# Altium schematic sheet DM1095_USB.SchDoc: =project_title
size Tabloid; PageSetup: Record=PageOptions|CenterHorizontal=True|CenterVertical=True|PrintScale=0.73|XCorrection=1.00|YCorrection=1.00|PrintKind=0|BorderSize=5000000|LeftOffset=0|BottomOffset=0|Orientation=2|PaperLength=1000|PaperWidth=1000|Scale=100|PaperSource=7|PrintQuality=-4|MediaType=1|DitherType=10|PaperKind=A4|PrintScaleMode=1; CompanyName: Luxonis Holding; Organization: Luxonis Holding; Address1: 1925 Harmony Park Drive; Address2: Westminster, CO; Address3: 80234; Address4: United States; SheetNumber: 8; SheetTotal: 9
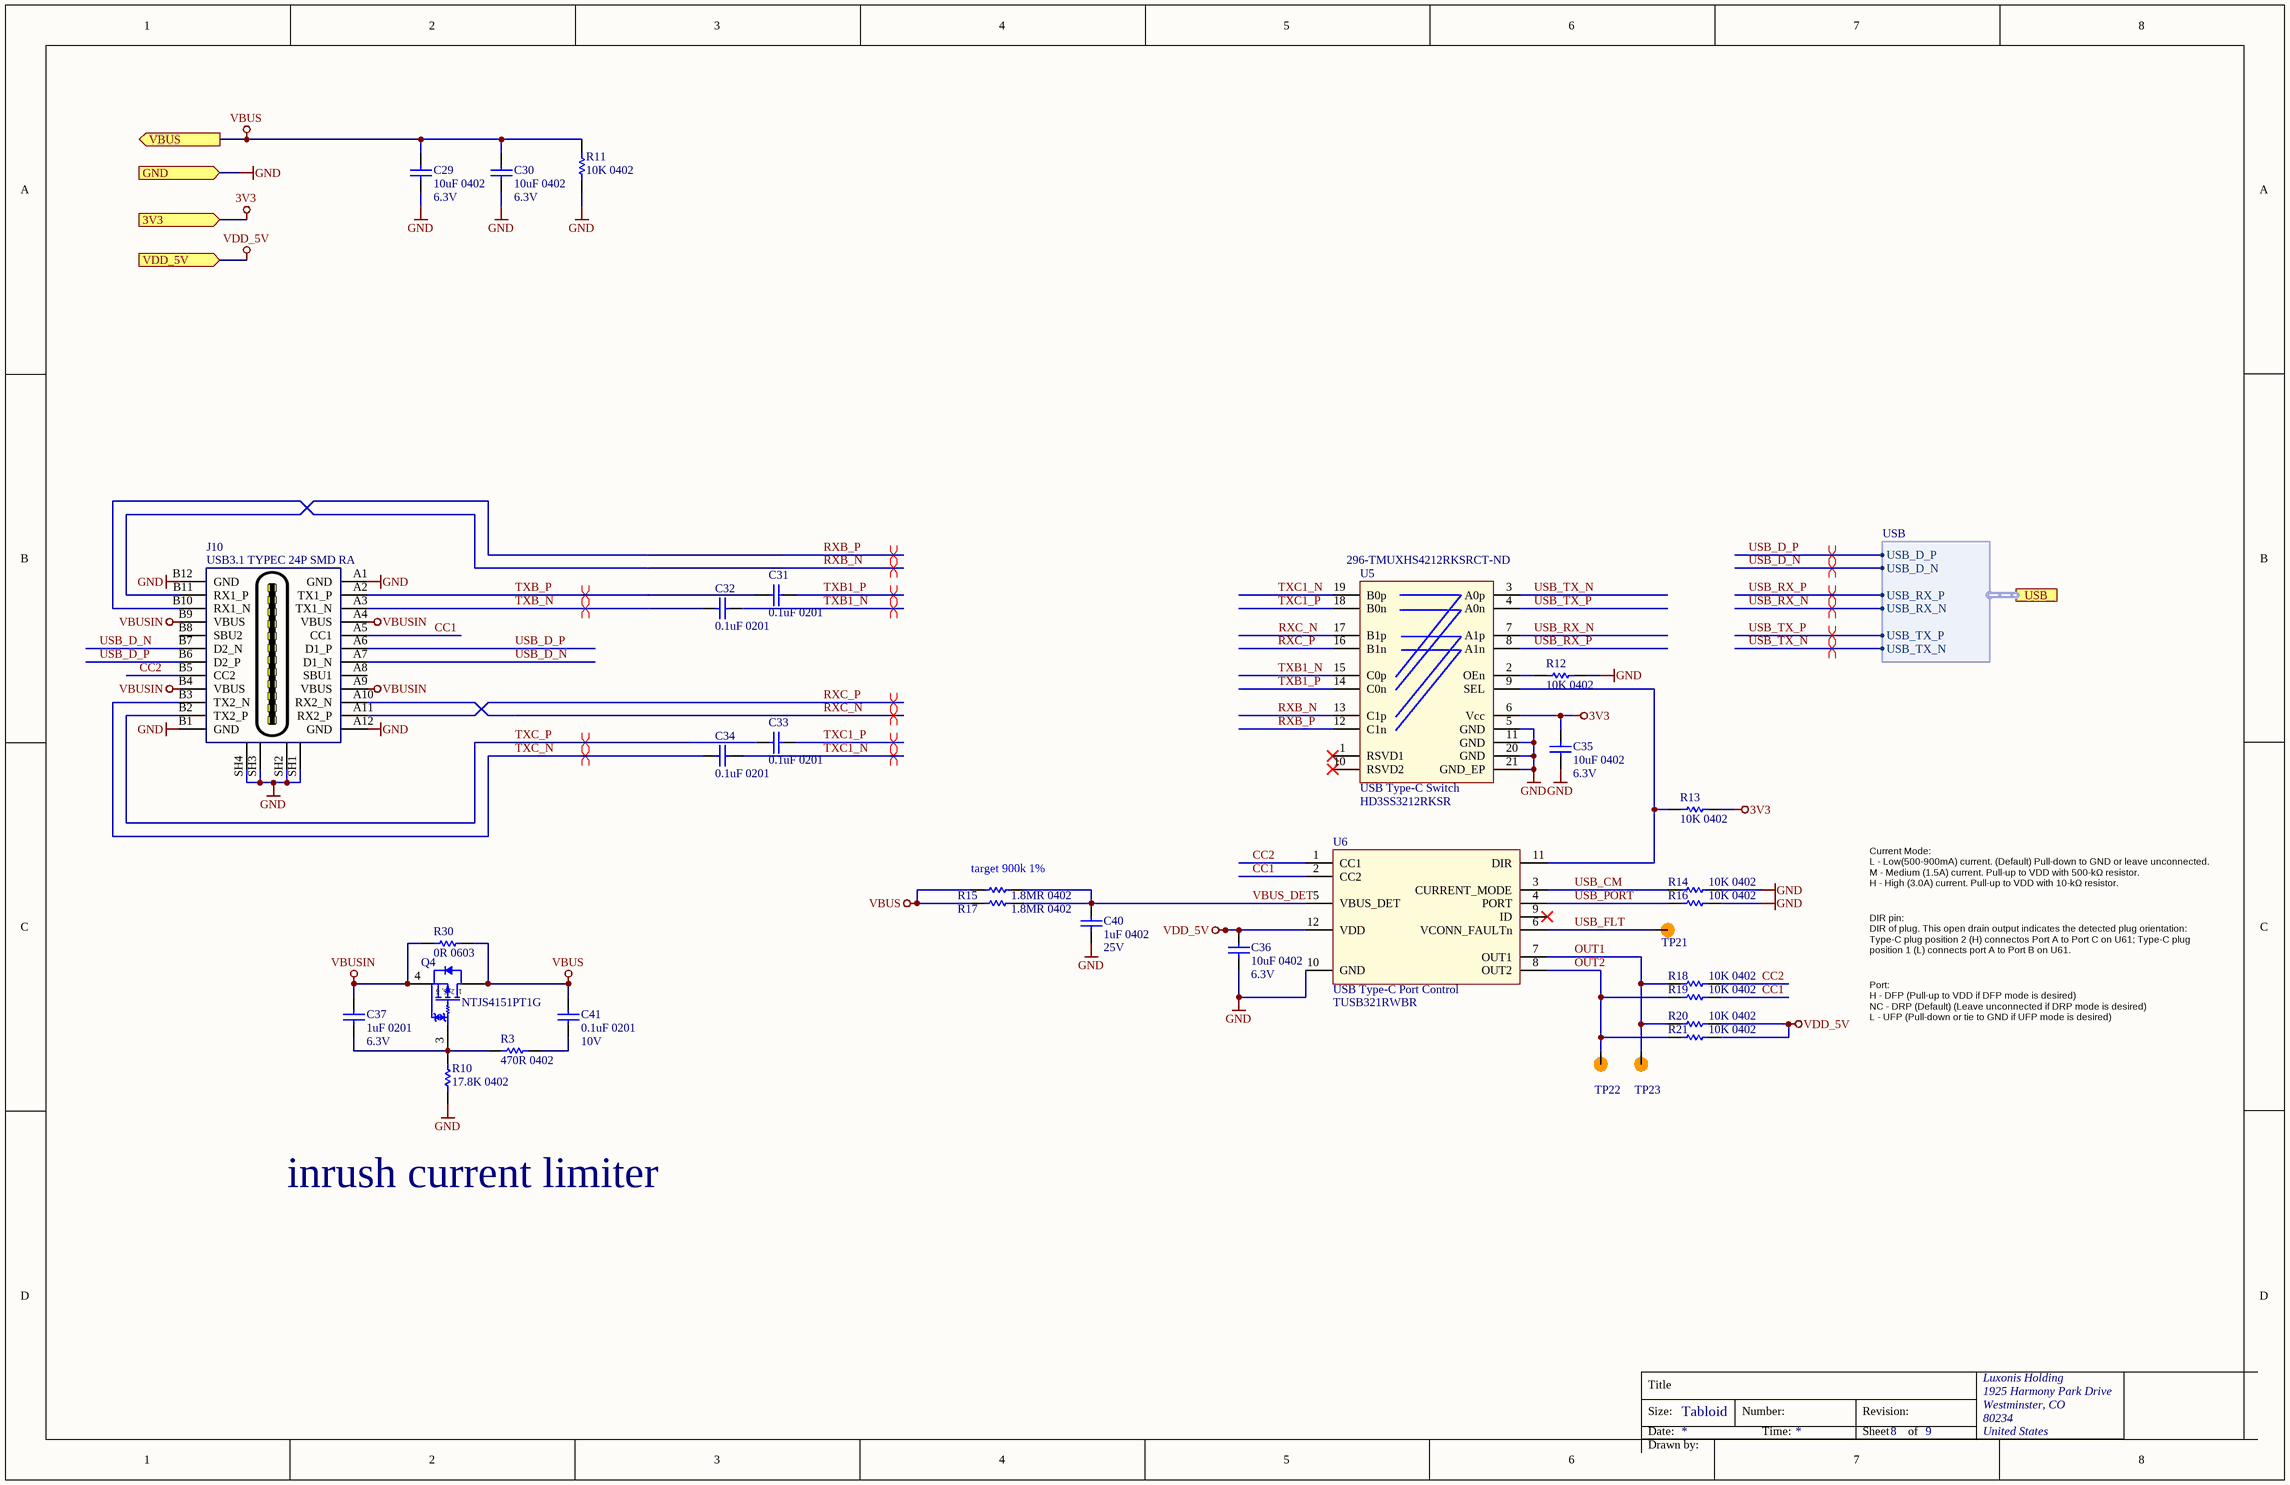
[diagram p0: DM1095_USB.SchDoc]

## Parts
C29  10uF 0402  Voltage Rating: 6.3V  [CAPC0402(1005)70_L]
C30  10uF 0402  Voltage Rating: 6.3V  [CAPC0402(1005)70_L]
C31  0.1uF 0201  [CAPC0201(0603)33_L]
C32  0.1uF 0201  [CAPC0201(0603)33_L]
C33  0.1uF 0201  [CAPC0201(0603)33_L]
C34  0.1uF 0201  [CAPC0201(0603)33_L]
C35  10uF 0402  Voltage Rating: 6.3V  [CAPC0402(1005)70_L]
C36  10uF 0402  Voltage Rating: 6.3V  [CAPC0402(1005)70_L]
C37  1uF 0201  Voltage: 6.3V  [CAPC0201(0603)33_N]
C40  1uF 0402  Voltage Rating: 25V  [CAPC0402(1005)70_N]
C41  0.1uF 0201  Voltage: 10V  [CAPC0201(0603)33_N]
J10  USB3.1 TYPEC 24P SMD RA  [105450-0101]
Q4  NTJS4151PT1G  [ONSC-SC70-6-419B-02_W_V]
R3  470R 0402  [RESC0402(1005)_L]
R10  17.8K 0402  [RESC0402(1005)_L]
R11  10K 0402  [RESC0402(1005)_L]
R12  10K 0402  [RESC0402(1005)_L]
R13  10K 0402  [RESC0402(1005)_L]
R14  10K 0402  [RESC0402(1005)_L]
R15  1.8MR 0402  [RESC0402(1005)_L]
R16  10K 0402  [RESC0402(1005)_L]
R17  1.8MR 0402  [RESC0402(1005)_L]
R18  10K 0402  [RESC0402(1005)_L]
R19  10K 0402  [RESC0402(1005)_L]
R20  10K 0402  [RESC0402(1005)_L]
R21  10K 0402  [RESC0402(1005)_L]
R30  0R 0603  [RESC0603(1608)_N]
TP21  TP100_200_NS  [TP100_200_NS]  (value not drawn)  (no BOM)
TP22  TP100_200_NS  [TP100_200_NS]  (value not drawn)  (no BOM)
TP23  TP100_200_NS  [TP100_200_NS]  (value not drawn)  (no BOM)
U5  USB Type-C Switch  Supplier Part Number 2: 296-TMUXHS4212RKSRCT-ND  [HD3SS3212RKSR]
U6  USB Type-C Port Control  [TUSB321RWBR]

## Ports
3V3 (in), GND (in), USB (harness USB), VBUS (out), VDD_5V (in)

## Harnesses
USB: USB_D_P, USB_D_N, USB_TX_N, USB_TX_P, USB_RX_N, USB_RX_P

## Nets
3V3: C35.2 R13.2 U5.6(Vcc) ; port 3V3
GND: C29.1 C30.1 C35.1 C36.1 C40.1 J10.A1(GND) J10.A12(GND) J10.B1(GND) J10.B12(GND) J10.SH1(SH) J10.SH2(SH) J10.SH3(SH) J10.SH4(SH) R10.1 R11.1 R12.2 R14.2 R16.2 U5.5(GND) U5.11(GND) U5.20(GND) U5.21(GND_EP) U6.10(GND) ; port GND
VBUS: C29.2 C30.2 C41.2 Q4.1(D) Q4.2(D) Q4.5(D) Q4.6(D) R11.2 R15.1 R17.1 R30.2 ; port VBUS
VBUSIN: C37.2 J10.A4(VBUS) J10.A9(VBUS) J10.B4(VBUS) J10.B9(VBUS) Q4.4(S) R30.1
VDD_5V: C36.2 R20.2 R21.2 U6.12(VDD) ; port VDD_5V
CC1: J10.A5(CC1) R19.2 U6.2(CC2)
CC2: J10.B5(CC2) R18.2 U6.1(CC1)
OUT1: R18.1 R20.1 TP23.1 U6.7(OUT1)
OUT2: R19.1 R21.1 TP22.1 U6.8(OUT2)
RXB_N: J10.B10(RX1_N) U5.13(C1p)
RXB_P: J10.B11(RX1_P) U5.12(C1n)
RXC_N: J10.A10(RX2_N) U5.17(B1p)
RXC_P: J10.A11(RX2_P) U5.16(B1n)
TXB1_N: C32.2 U5.15(C0p)
TXB1_P: C31.2 U5.14(C0n)
TXB_N: C32.1 J10.A3(TX1_N)
TXB_P: C31.1 J10.A2(TX1_P)
TXC1_N: C34.2 U5.19(B0p)
TXC1_P: C33.2 U5.18(B0n)
TXC_N: C34.1 J10.B3(TX2_N)
TXC_P: C33.1 J10.B2(TX2_P)
USB_CM: R14.1 U6.3(CURRENT_MODE)
USB_D_N: J10.A7(D1_N) J10.B7(D2_N) ; port USB.USB_D_N
USB_D_P: J10.A6(D1_P) J10.B6(D2_P) ; port USB.USB_D_P
USB_FLT: TP21.1 U6.6(VCONN_FAULTn)
USB_PORT: R16.1 U6.4(PORT)
USB_RX_N: U5.7(A1p) ; port USB.USB_RX_N
USB_RX_P: U5.8(A1n) ; port USB.USB_RX_P
USB_TX_N: U5.3(A0p) ; port USB.USB_TX_N
USB_TX_P: U5.4(A0n) ; port USB.USB_TX_P
VBUS_DET: C40.2 R15.2 R17.2 U6.5(VBUS_DET)
NetC37_1: C37.1 Q4.3(G) R3.1 R10.2
NetC41_1: C41.1 R3.2
NetR12_1: R12.1 U5.2(OEn)
NetR13_1: R13.1 U5.9(SEL) U6.11(DIR)

Not connected (* = marked no-connect by the designer): J10 A8(SBU1) B8(SBU2); U5 1(RSVD1)* 10(RSVD2)*; U6 9(ID)*

## Layout directives
differential pair; differential pair class USB3: RXB_N, RXB_P, RXC_N, RXC_P, TXB1_N, TXB1_P, TXB_N, TXB_P, TXC1_N, TXC1_P, TXC_N, TXC_P, USB_D_N, USB_D_P, USB_RX_N, USB_RX_P, USB_TX_N, USB_TX_P

## Notes on the sheet
- (near R15) target 900k 1%
- Current Mode:
  L - Low(500-900mA) current. (Default) Pull-down to GND or leave unconnected.
  M - Medium (1.5A) current. Pull-up to VDD with 500-kΩ resistor.
  H - High (3.0A) current. Pull-up to VDD with 10-kΩ resistor.
- DIR pin:
  DIR of plug. This open drain output indicates the detected plug orientation: Type-C plug position 2 (H) connectos Port A to Port C on U61; Type-C plug position 1 (L) connects port A to Port B on U61.
- Port:
  H - DFP (Pull-up to VDD if DFP mode is desired)
  NC - DRP (Default) (Leave unconnected if DRP mode is desired)
  L - UFP (Pull-down or tie to GND if UFP mode is desired)
- inrush current limiter
- Title
- Size:
- Date:
- Tabloid
- Number:
- Time:
- Revision:
- Sheet
- of
- Drawn by:
- (in symbol NTJS4151PT1G) 1, 2, 5, 6

## Library data of the parts
C29 C30 C35 C36 = GRM155R60J106ME15D: CAP CER 10UF 6.3V X5R 0402 20%; Manufacturer 1: Murata; Supplier 1: Digi-Key; Manufacturer Part Number 1: GRM155R60J106ME15D; Stock 1: 1839627; Pricing 1: 1=0.23000, 10=0.15700, 100=0.07950, 500=0.05442, 1000=0.04814, 2500=0.04605, 5000=0.04186 (USD); RoHS: Yes; Mount: Surface Mount; Case/Package: 0402; Case Code (Metric): 1005; Case Code (Imperial): 0402; Min Operating Temperature: -55°C; Max Operating Temperature: 85°C; Packaging: Tape and Reel; Capacitance: 10uF; Dielectric: X5R; Length: 0.039inch; Width: 0.02inch; ComponentLink1URL: https://www.murata.com/~/media/webrenewal/support/library/catalog/products/capacitor/mlcc/c02e.ashx?la=en-us&src-supplier=Digi-Key; ComponentLink1Description: https://www.murata.com/~/media/webrenewal/support/library/catalog/products/capacitor/mlcc/c02e.ashx?la=en-us&src-supplier=Digi-Key; Supplier Part Number 1: 490-13238-1-ND; Voltage Rating (DC): 6.3V; Thickness: 0.026inch; Tolerance: 20%
C31-C34 C41 = GRM033R61A104KE15D: CAP CER 0.1UF 10V X5R 0201; Manufacturer 1: Murata; Capacitance: 100nF; Tolerance: 10%; Supplier 1: Digi-Key; Manufacturer Part Number 1: GRM033R61A104KE15D; Stock 1: 45335312; Pricing 1: 1=0.10000, 10=0.04200, 100=0.01860, 500=0.01330, 1000=0.01045, 2500=0.00950, 5000=0.00874 (USD); RoHS: Yes; Mount: Surface Mount; Case/Package: 0201; Weight: 6E-06oz; Case Code (Metric): 0603; Case Code (Imperial): 0201; Min Operating Temperature: -55°C; Max Operating Temperature: 85°C; Packaging: Tape and Reel; Voltage Rating: 10V; Package Quantity: 1; Voltage Rating (DC): 10V; Dielectric: X5R; Termination: SMD/SMT; Length: 0.6mm; Height: 0.3mm; Width: 0.012inch; Thickness: 0.013inch; Depth: 0.3mm; Radiation Hardening: No; Lead Free: Lead Free; REACH SVHC: No SVHC; ComponentLink1URL: https://datasheet.ciiva.com/26843/getdatasheetpartid-308656-26843739.pdf?src-supplier=Verical; ComponentLink1Description: https://datasheet.ciiva.com/26843/getdatasheetpartid-308656-26843739.pdf?src-supplier=Verical; ComponentLink2URL: https://datasheet.ciiva.com/5413/product-5413117.pdf?src-supplier=Mouser; ComponentLink2Description: https://datasheet.ciiva.com/5413/product-5413117.pdf?src-supplier=Mouser; ComponentLink3URL: https://datasheet.ciiva.com/6256/partnumbering-e-01-6256406.pdf?src-supplier=Digi-Key; ComponentLink3Description: https://datasheet.ciiva.com/6256/partnumbering-e-01-6256406.pdf?src-supplier=Digi-Key; ComponentLink4URL: https://datasheet.ciiva.com/6256/partnumbering-e-01-6256407.pdf?src-supplier=Digi-Key; ComponentLink4Description: https://datasheet.ciiva.com/6256/partnumbering-e-01-6256407.pdf?src-supplier=Digi-Key; ComponentLink5URL: https://datasheet.ciiva.com/6256/partnumbering-e-01-6256408.pdf?src-supplier=Digi-Key; ComponentLink5Description: https://datasheet.ciiva.com/6256/partnumbering-e-01-6256408.pdf?src-supplier=Digi-Key; Supplier Part Number 1: 490-5881-1-ND
  C31-C34: Voltage: 10V
C37 = GRM033R60J105MEA2D: CAP CER 1UF 6.3V X5R 0201 20%; Manufacturer 1: Murata; Supplier 1: Digi-Key; Manufacturer Part Number 1: GRM033R60J105MEA2D; Stock 1: 26228841; Pricing 1: 1=0.12000, 10=0.08500, 100=0.04000, 500=0.02806, 1000=0.02323, 2500=0.02162, 5000=0.01978 (USD); RoHS: Yes; Mount: Surface Mount; Case/Package: 0201; Weight: 1.2E-05oz; Case Code (Imperial): 0201; Case Code (Metric): 0603; Min Operating Temperature: -55°C; Max Operating Temperature: 85°C; Packaging: Cut Tape; Capacitance: 1uF; Tolerance: 20%; Voltage Rating: 6.3V; Voltage Rating (DC): 6.3V; Dielectric: X5R; Package Quantity: 1; Termination: SMD/SMT; Length: 0.6mm; Height: 0.3mm; Width: 0.3mm; Thickness: 300um; Depth: 0.3mm; REACH SVHC: No SVHC; Lead Free: Lead Free; ComponentLink1URL: https://datasheet.ciiva.com/18699/grm033r60j105mea2-02-18699520.pdf?src-supplier=Digi-Key; ComponentLink1Description: https://datasheet.ciiva.com/18699/grm033r60j105mea2-02-18699520.pdf?src-supplier=Digi-Key; ComponentLink2URL: https://datasheet.ciiva.com/24218/c02e-24218376.pdf?src-supplier=Mouser; ComponentLink2Description: https://datasheet.ciiva.com/24218/c02e-24218376.pdf?src-supplier=Mouser; ComponentLink3URL: https://datasheet.ciiva.com/18699/partnumbering-e-01-18699519.pdf?src-supplier=Digi-Key; ComponentLink3Description: https://datasheet.ciiva.com/18699/partnumbering-e-01-18699519.pdf?src-supplier=Digi-Key; Supplier Part Number 1: 490-7229-1-ND
C40 = GRM155R61E105KA12D: CAP CER 1UF 25V X5R 0402 10%; Manufacturer 1: Murata; Material: Ceramic; Supplier 1: Digi-Key; Manufacturer Part Number 1: GRM155R61E105KA12D; Stock 1: 200653; Pricing 1: 1=0.10000, 10=0.07100, 100=0.03350, 500=0.02352, 1000=0.01947, 2500=0.01812, 5000=0.01658 (USD); RoHS: Yes; Mount: Surface Mount; Case/Package: 0402; Weight: 0.000212oz; Case Code (Metric): 1005; Case Code (Imperial): 0402; Min Operating Temperature: -55°C; Max Operating Temperature: 85°C; Tolerance: 10%; Capacitance: 1uF; Dielectric: X5R; Voltage Rating (DC): 25V; Packaging: Tape and Reel; Package Quantity: 10000; Termination: SMD/SMT; Voltage: 25V; Length: 1mm; Height: 0.5mm; Width: 0.5mm; Thickness: 0.022inch; Depth: 0.5mm; Lead Free: Lead Free; REACH SVHC: No SVHC; ComponentLink1URL: https://datasheet.ciiva.com/22732/1666664-22732122.pdf?src-supplier=Element14; ComponentLink1Description: https://datasheet.ciiva.com/22732/1666664-22732122.pdf?src-supplier=Element14; ComponentLink2URL: https://datasheet.ciiva.com/7719/1666664-7719006.pdf?src-supplier=Element14; ComponentLink2Description: https://datasheet.ciiva.com/7719/1666664-7719006.pdf?src-supplier=Element14; Supplier Part Number 1: 490-10017-1-ND; Supplier 2: Arrow; Supplier 3: TTI; Supplier Part Number 2: GRM155R61E105KA12D; Supplier Part Number 3: GRM155R61E105KA12D
J10 = 105450-0101: CONN RCP USB3.1 TYPEC 24P SMD RA; Manufacturer 1: Molex; Connector Type: USB; Number of Contacts: 24; Gender: Receptacle; Number of Ports: 1; Current Rating: 5A; Mating Cycles: 10000; Shielding: Shielded; Pitch: 0.5mm; Supplier 1: Digi-Key; Manufacturer Part Number 1: 105450-0101; Stock 1: 13882; Pricing 1: 1=2.15000, 10=1.94900, 25=1.82960, 50=1.75000, 100=1.67050, 250=1.51140, 500=1.39208 (USD); RoHS: Yes; Mount: Surface Mount,Through Hole,Horizontal; Case/Package: 0101; Number of Pins: 24; Contact Material: Copper Alloy; Contact Plating: Gold; Number of Terminals: 24; Housing Material: Thermoplastic; Insulation Color: Black; Min Operating Temperature: -30°C; Max Operating Temperature: 85°C; Packaging: Tape and Reel; Orientation: Right Angle; Termination: Solder; USB Standard: USB 3.1; Features: Shielded; Length: 8.94mm; REACH SVHC: Unknown; Flammability Rating: UL94 V-0; ComponentLink1URL: http://www.farnell.com/datasheets/2673427.pdf?src-supplier=Farnell; ComponentLink1Description: http://www.farnell.com/datasheets/2673427.pdf?src-supplier=Farnell; ComponentLink2URL: http://www.farnell.com/datasheets/2801634.pdf?src-supplier=Farnell; ComponentLink2Description: http://www.farnell.com/datasheets/2801634.pdf?src-supplier=Farnell; ComponentLink3URL: http://www.farnell.com/datasheets/2672741.pdf?src-supplier=Newark; ComponentLink3Description: http://www.farnell.com/datasheets/2672741.pdf?src-supplier=Newark; ComponentLink4URL: https://www.molex.com/pdm_docs/sd/1054500101_sd.pdf?src-supplier=Digi-Key; ComponentLink4Description: https://www.molex.com/pdm_docs/sd/1054500101_sd.pdf?src-supplier=Digi-Key; ComponentLink5URL: https://www.molex.com/pdm_docs/ps/PS-105448-001.pdf?src-supplier=Digi-Key; ComponentLink5Description: https://www.molex.com/pdm_docs/ps/PS-105448-001.pdf?src-supplier=Digi-Key; ComponentLink6URL: http://www.farnell.com/datasheets/2015275.pdf?src-supplier=Element14; ComponentLink6Description: http://www.farnell.com/datasheets/2015275.pdf?src-supplier=Element14; ComponentLink7URL: http://www.literature.molex.com/SQLImages/kelmscott/Molex/PDF_Images/987651-4081.PDF?src-supplier=Avnet; ComponentLink7Description: http://www.literature.molex.com/SQLImages/kelmscott/Molex/PDF_Images/987651-4081.PDF?src-supplier=Avnet; ComponentLink8URL: http://www.literature.molex.com/SQLImages/kelmscott/Molex/PDF_Images/987651-4081.PDF?src-supplier=Avnet+Asia; ComponentLink8Description: http://www.literature.molex.com/SQLImages/kelmscott/Molex/PDF_Images/987651-4081.PDF?src-supplier=Avnet+Asia; Supplier Part Number 1: WM12856CT-ND; Supplier 2: Newark; Supplier 3: Mouser; Supplier Part Number 2: 02AH5567; Supplier Part Number 3: 538-105450-0101
Q4 = NTJS4151PT1G: Trench Power MOSFET, -20 V, -4.2 A, Single P-Channel, 6-Pin SC70, Pb-Free, Tape and Reel; Manufacturer 1: ON Semiconductor; VGS(th) Max (V): 1.2; VGS Max (V): 12; Crss Typ (pF): 110; Ciss Typ (pF): 850; PD Max (W): 1; Qrr Typ (nC): 0.23; ID Max (A): 4.2; Coss Typ (pF): 160; Channel Polarity: P Channel; V(BR)DSS Min (V): 20; Mounting Technology: Surface Mount; ComponentLink3Description: Package Specification; Packing: Tape and Reel; DatasheetVersion: Rev. 1; RoHS: Pb-Free; Configuration: Single; PackageReference: SC70-6-419B-02_W; PackageVersion: Rev. W; Package Type: SC-88-6 / SC-70-6 / SOT-363-6; ComponentLink3URL: http://www.onsemi.com/pub_link/Collateral/SMF05C-D.PDF; PackageDescription: 6-Pin Small Outline Transistor, Body 2 x 1.25 mm, Pitch 0.65 mm; PartNumber: NTJS4151PT1G; ComponentLink2Description: Datasheet; ComponentLink1Description: Manufacturer URL; ComponentLink2URL: http://www.onsemi.com/pub_link/Collateral/NTJS4151P-D.PDF; ComponentLink1URL: http://www.onsemi.com/; Manufacturer Part Number 1: NTJS4151PT1G
R3 = CRCW0402470RFKED: RES SMD 470 OHM 1% 1/16W 0402; Manufacturer 1: Vishay; Temperature Coefficient: 100ppm/°C; Power Rating: 63mW; Voltage Rating: 50V; Supplier 1: Digi-Key; Manufacturer Part Number 1: CRCW0402470RFKED; Stock 1: 9199; Pricing 1: 1=0.10000, 10=0.03800, 100=0.01540, 1000=0.00690, 2500=0.00599, 5000=0.00495 (USD); RoHS: Yes; Mount: Surface Mount; Case/Package: 0402; Weight: 2.3E-05oz; Case Code (Imperial): 0402; Case Code (Metric): 1005; Contact Plating: Tin; Min Operating Temperature: -55°C; Max Operating Temperature: 155°C; Resistance: 470R; Tolerance: 1%; Composition: Thick Film; Packaging: Tape and Reel; Voltage Rating (DC): 50V; Termination: SMD/SMT; Number of Terminations: 2; Package Quantity: 10; Military Standard: Not; Max Power Dissipation: 63mW; Features: Automotive AEC-Q200; Length: 1mm; Height: 0.35mm; Width: 0.5mm; Depth: 0.5mm; Radiation Hardening: No; REACH SVHC: Unknown; Lead Free: Lead Free; ComponentLink1URL: https://datasheet.ciiva.com/11811/0900766b80d98824-11811416.pdf?src-supplier=RSComponents; ComponentLink1Description: https://datasheet.ciiva.com/11811/0900766b80d98824-11811416.pdf?src-supplier=RSComponents; ComponentLink2URL: https://datasheet.ciiva.com/16764/70201119-16764886.pdf?src-supplier=Allied+Electronics; ComponentLink2Description: https://datasheet.ciiva.com/16764/70201119-16764886.pdf?src-supplier=Allied+Electronics; ComponentLink3URL: https://datasheet.ciiva.com/28613/1720486-28613479.pdf?src-supplier=Element14; ComponentLink3Description: https://datasheet.ciiva.com/28613/1720486-28613479.pdf?src-supplier=Element14; ComponentLink4URL: https://datasheet.ciiva.com/3256/dcrcwe3-3256553.pdf?src-supplier=Avnet; ComponentLink4Description: https://datasheet.ciiva.com/3256/dcrcwe3-3256553.pdf?src-supplier=Avnet; ComponentLink5URL: https://datasheet.ciiva.com/7777/1720486-7777243.pdf?src-supplier=Element14; ComponentLink5Description: https://datasheet.ciiva.com/7777/1720486-7777243.pdf?src-supplier=Element14; ComponentLink6URL: https://datasheet.ciiva.com/8336/dcrcwe3-8336715.pdf?src-supplier=Avnet; ComponentLink6Description: https://datasheet.ciiva.com/8336/dcrcwe3-8336715.pdf?src-supplier=Avnet; ComponentLink7URL: https://datasheet.ciiva.com/7777/1697337-7777244.pdf?src-supplier=Element14; ComponentLink7Description: https://datasheet.ciiva.com/7777/1697337-7777244.pdf?src-supplier=Element14; ComponentLink8URL: https://datasheet.ciiva.com/2463/dcrcwe3-2463085.pdf?src-supplier=Digi-Key; ComponentLink8Description: https://datasheet.ciiva.com/2463/dcrcwe3-2463085.pdf?src-supplier=Digi-Key; ComponentLink9URL: https://datasheet.ciiva.com/16362/dcrcwe3-16362109.pdf?src-supplier=Future+Electronics; ComponentLink9Description: https://datasheet.ciiva.com/16362/dcrcwe3-16362109.pdf?src-supplier=Future+Electronics; ComponentLink10URL: https://datasheet.ciiva.com/16882/dcrcwe3-16882493.pdf?src-supplier=Avnet+Europe; ComponentLink10Description: https://datasheet.ciiva.com/16882/dcrcwe3-16882493.pdf?src-supplier=Avnet+Europe; ComponentLink11URL: https://datasheet.ciiva.com/2463/dcrcwe3-2463086.pdf?src-supplier=Digi-Key; ComponentLink11Description: https://datasheet.ciiva.com/2463/dcrcwe3-2463086.pdf?src-supplier=Digi-Key; ComponentLink12URL: https://datasheet.ciiva.com/2463/dcrcwe3-2463087.pdf?src-supplier=Digi-Key; ComponentLink12Description: https://datasheet.ciiva.com/2463/dcrcwe3-2463087.pdf?src-supplier=Digi-Key; Supplier 2: Newark; Supplier Part Number 1: 541-470LCT-ND; Supplier Part Number 2: 26W9133
R10 = ERJ-2RKF1782X: RES SMD 17.8K OHM 1% 1/10W 0402 17.8 kOhms ±1% 0.1W, 1/10W Chip Resistor 0402 (1005 Metric) Automotive AEC-Q200 Thick Film; Manufacturer 1: Panasonic; Temperature Coefficient: 100ppm/°C; Power Rating: 100mW; Voltage Rating: 50V; Resistance: 17.8kR; RoHS: Yes; Mount: Surface Mount; Case Code (Metric): 1005; Case Code (Imperial): 0402; Contact Plating: Tin; Min Operating Temperature: -55°C; Max Operating Temperature: 155°C; Packaging: Tape and Reel; Composition: Thick Film; Termination: SMD/SMT; Package Quantity: 1; Voltage Rating (DC): 50V; Military Standard: Not; Number of Terminations: 2; Max Power Dissipation: 100mW; Features: Automotive AEC-Q200; Length: 1mm; Height: 0.35mm; Width: 0.02inch; Depth: 0.5mm; Lead Free: Lead Free; REACH SVHC: Unknown; ComponentLink1URL: https://datasheet.ciiva.com/24027/aoa0000ce2-24027013.pdf?src-supplier=Mouser; ComponentLink1Description: https://datasheet.ciiva.com/24027/aoa0000ce2-24027013.pdf?src-supplier=Mouser; ComponentLink2URL: https://datasheet.ciiva.com/46372/1678782-46372997.pdf?src-supplier=Element14; ComponentLink2Description: https://datasheet.ciiva.com/46372/1678782-46372997.pdf?src-supplier=Element14; ComponentLink3URL: https://datasheet.ciiva.com/28594/1694929-28594534.pdf?src-supplier=Element14; ComponentLink3Description: https://datasheet.ciiva.com/28594/1694929-28594534.pdf?src-supplier=Element14; ComponentLink4URL: https://datasheet.ciiva.com/46372/1678782-46372998.pdf?src-supplier=Element14; ComponentLink4Description: https://datasheet.ciiva.com/46372/1678782-46372998.pdf?src-supplier=Element14; ComponentLink5URL: https://datasheet.ciiva.com/22764/1678782-22764807.pdf?src-supplier=Farnell; ComponentLink5Description: https://datasheet.ciiva.com/22764/1678782-22764807.pdf?src-supplier=Farnell; ComponentLink6URL: https://datasheet.ciiva.com/16769/70260748-16769816.pdf?src-supplier=Allied+Electronics; ComponentLink6Description: https://datasheet.ciiva.com/16769/70260748-16769816.pdf?src-supplier=Allied+Electronics; ComponentLink7URL: https://datasheet.ciiva.com/30116/aoa0000ce2-30116554.pdf?src-supplier=Onlinecomponents.com; ComponentLink7Description: https://datasheet.ciiva.com/30116/aoa0000ce2-30116554.pdf?src-supplier=Onlinecomponents.com; ComponentLink8URL: https://datasheet.ciiva.com/16775/70260748-16775211.pdf?src-supplier=Allied+Electronics; ComponentLink8Description: https://datasheet.ciiva.com/16775/70260748-16775211.pdf?src-supplier=Allied+Electronics; ComponentLink9URL: https://datasheet.ciiva.com/43467/1678782-43467419.pdf?src-supplier=Farnell; ComponentLink9Description: https://datasheet.ciiva.com/43467/1678782-43467419.pdf?src-supplier=Farnell; ComponentLink10URL: https://datasheet.ciiva.com/22668/1678782-22668623.pdf?src-supplier=Element14; ComponentLink10Description: https://datasheet.ciiva.com/22668/1678782-22668623.pdf?src-supplier=Element14; Supplier 1: Digi-Key; Manufacturer Part Number 1: ERJ-2RKF1782X; Stock 1: 250542; Pricing 1: 1=0.10000, 10=0.04500, 100=0.01830, 1000=0.00823, 2500=0.00715, 5000=0.00590 (USD); Case/Package: 0402; Tolerance: 1%; Supplier Part Number 1: P17.8KLCT-ND
R11-R14 R16 R18-R21 = RC0402FR-1310KL: RES SMD 10K OHM 1% 0402 1/16W Chip Resistor, 0402 [1005 Metric], 10 kohm, RC Series, 50 V, Thick Film, 62.5 mW; Manufacturer 1: Yageo; Resistance: 10kR; Temperature Coefficient: 100ppm/°C; Power Rating: 62.5mW; Voltage Rating: 50V; ComponentLink1URL: https://datasheet.ciiva.com/16940/pyu-rc0402-51-rohs-l-6-16940293.pdf?src-supplier=Avnet+Europe; ComponentLink1Description: https://datasheet.ciiva.com/16940/pyu-rc0402-51-rohs-l-6-16940293.pdf?src-supplier=Avnet+Europe; ComponentLink2URL: https://datasheet.ciiva.com/28386/pyu-rc0402-51-rohs-l-6-28386855.pdf?src-supplier=Avnet+Europe; ComponentLink2Description: https://datasheet.ciiva.com/28386/pyu-rc0402-51-rohs-l-6-28386855.pdf?src-supplier=Avnet+Europe; ComponentLink3URL: https://datasheet.ciiva.com/16740/pyu-rc0402-51-rohs-l-6-r-16740602.pdf?src-supplier=Future+Electronics; ComponentLink3Description: https://datasheet.ciiva.com/16740/pyu-rc0402-51-rohs-l-6-r-16740602.pdf?src-supplier=Future+Electronics; ComponentLink4URL: https://datasheet.ciiva.com/8891/pyu-rc0402-51-rohs-l-6-8891339.pdf?src-supplier=Avnet; ComponentLink4Description: https://datasheet.ciiva.com/8891/pyu-rc0402-51-rohs-l-6-8891339.pdf?src-supplier=Avnet; ComponentLink5URL: https://datasheet.ciiva.com/5557/pyu-rc0402-51-rohs-l-6-r-5557997.pdf?src-supplier=Mouser; ComponentLink5Description: https://datasheet.ciiva.com/5557/pyu-rc0402-51-rohs-l-6-r-5557997.pdf?src-supplier=Mouser; ComponentLink6URL: https://datasheet.ciiva.com/7983/1018594-7983533.pdf?src-supplier=Element14; ComponentLink6Description: https://datasheet.ciiva.com/7983/1018594-7983533.pdf?src-supplier=Element14; Supplier 1: Newark; Manufacturer Part Number 1: RC0402FR-1310KL; Stock 1: 62239; Pricing 1: 1=0.10000, 25=0.01200, 100=0.00400, 250=0.00400, 500=0.00300, 1000=0.00300 (USD); RoHS: Yes; Case/Package: 0402; Number of Pins: 2; Contact Plating: Tin,Matte,Lead; Case Code (Imperial): 0402; Case Code (Metric): 1005; Min Operating Temperature: -55°C; Max Operating Temperature: 155°C; Tolerance: 1%; Composition: Thick Film; Packaging: Tape and Reel; Termination: SMD/SMT; Military Standard: Not; Voltage Rating (DC): 50V; Working Voltage: 50V; Number of Terminations: 2; Length: 1mm; Depth: 0.5mm; Radiation Hardening: No; REACH SVHC: No SVHC; Lead Free: Lead Free; Supplier Part Number 1: 67R9960; Supplier 2: Future Electronics; Supplier 3: Mouser; Supplier 4: Element14; Supplier Part Number 2: RC0402FR-1310KL-CUTT; Supplier Part Number 3: 603-RC0402FR-1310KL; Supplier Part Number 4: 1799235
R15 R17 = CRCW04021M80FKED: RES SMD 1.8M OHM 1% 1/16W 0402; Manufacturer 1: Vishay; Voltage Rating: 50V; Temperature Coefficient: 100ppm/°C; Power Rating: 63mW; Supplier 1: Digi-Key; Manufacturer Part Number 1: CRCW04021M80FKED; Stock 1: 26061; Pricing 1: 1=0.10000, 10=0.03800, 100=0.01540, 1000=0.00690, 2500=0.00599, 5000=0.00495 (USD); RoHS: Yes; Mount: Surface Mount; Case/Package: 0402; Number of Pins: 2; Weight: 2.3E-05oz; Case Code (Imperial): 0402; Case Code (Metric): 1005; Contact Plating: Tin; Min Operating Temperature: -55°C; Max Operating Temperature: 155°C; Packaging: Tape and Reel; Package Quantity: 10000; Termination: SMD/SMT; Voltage Rating (DC): 50V; Composition: Thick Film; Tolerance: 1%; Military Standard: Not; Resistance: 1.8MR; Length: 1mm; Height: 0.35mm; Width: 0.5mm; Depth: 0.5mm; Radiation Hardening: No; Lead Free: Lead Free; REACH SVHC: Unknown; ComponentLink1URL: https://datasheet.ciiva.com/11812/0900766b80d98824-11812579.pdf?src-supplier=RSComponents; ComponentLink1Description: https://datasheet.ciiva.com/11812/0900766b80d98824-11812579.pdf?src-supplier=RSComponents; ComponentLink2URL: https://datasheet.ciiva.com/16886/dcrcwe3-16886536.pdf?src-supplier=Avnet+Europe; ComponentLink2Description: https://datasheet.ciiva.com/16886/dcrcwe3-16886536.pdf?src-supplier=Avnet+Europe; ComponentLink3URL: https://datasheet.ciiva.com/7800/1697337-7800987.pdf?src-supplier=Element14; ComponentLink3Description: https://datasheet.ciiva.com/7800/1697337-7800987.pdf?src-supplier=Element14; ComponentLink4URL: https://datasheet.ciiva.com/16786/70201119-16786875.pdf?src-supplier=Allied+Electronics; ComponentLink4Description: https://datasheet.ciiva.com/16786/70201119-16786875.pdf?src-supplier=Allied+Electronics; ComponentLink5URL: https://datasheet.ciiva.com/22676/1700796-22676027.pdf?src-supplier=Element14; ComponentLink5Description: https://datasheet.ciiva.com/22676/1700796-22676027.pdf?src-supplier=Element14; ComponentLink6URL: https://datasheet.ciiva.com/7800/1697337-7800988.pdf?src-supplier=Element14; ComponentLink6Description: https://datasheet.ciiva.com/7800/1697337-7800988.pdf?src-supplier=Element14; ComponentLink7URL: https://datasheet.ciiva.com/26316/fld-crcw-e3-data-en-26316605.pdf?src-supplier=Distrelec; ComponentLink7Description: https://datasheet.ciiva.com/26316/fld-crcw-e3-data-en-26316605.pdf?src-supplier=Distrelec; ComponentLink8URL: https://datasheet.ciiva.com/8336/dcrcwe3-8336646.pdf?src-supplier=Avnet; ComponentLink8Description: https://datasheet.ciiva.com/8336/dcrcwe3-8336646.pdf?src-supplier=Avnet; Supplier Part Number 1: 541-1.80MLCT-ND
R30 = CRCW06030000Z0EA: RES SMD 0 OHM JUMPER 1/10W 0603 0 Ohms Jumper 0.1W, 1/10W Chip Resistor 0603 (1608 Metric) Automotive AEC-Q200 Thick Film; Manufacturer 1: Vishay; Manufacturer Part Number 1: CRCW0603-0000Z0EA; Resistance: 0mR; Power Rating: 100mW; Voltage Rating: 75V; Temperature Coefficient: 100ppm/°C; Tolerance: 5%; Current Rating: 2A; Supplier 1: Digi-Key; Stock 1: 742743; Pricing 1: 1=0.100000, 10=0.034000, 25=0.024400, 50=0.018600, 100=0.013800, 250=0.010480, 500=0.008400, 1000=0.006180 (USD); RoHS: Yes; Mount: Surface Mount; Case/Package: 0603; Weight: 7.1E-05oz; Contact Plating: Tin,Lead; Case Code (Metric): 1608; Case Code (Imperial): 0603; Min Operating Temperature: -55°C; Max Operating Temperature: 155°C; Composition: Thick Film; Termination: SMD/SMT; Packaging: Tape and Reel; Package Quantity: 1; Number of Terminations: 2; Military Standard: Not; Max Power Dissipation: 100mW; Voltage Rating (DC): 75V; Features: Automotive AEC-Q200; Working Voltage: 75V; Length: 1.55mm; Height: 0.02inch; Width: 0.033inch; Depth: 0.85mm; Radiation Hardening: No; Lead Free: Lead Free; REACH SVHC: Unknown; ComponentLink1URL: https://datasheet.ciiva.com/2461/dcrcwe3-2461968.pdf?src-supplier=Digi-Key; ComponentLink1Description: https://datasheet.ciiva.com/2461/dcrcwe3-2461968.pdf?src-supplier=Digi-Key; ComponentLink2URL: https://datasheet.ciiva.com/2461/dcrcwe3-2461969.pdf?src-supplier=Digi-Key; ComponentLink2Description: https://datasheet.ciiva.com/2461/dcrcwe3-2461969.pdf?src-supplier=Digi-Key; ComponentLink3URL: https://datasheet.ciiva.com/2461/dcrcwe3-2461970.pdf?src-supplier=Digi-Key; ComponentLink3Description: https://datasheet.ciiva.com/2461/dcrcwe3-2461970.pdf?src-supplier=Digi-Key; ComponentLink4URL: https://datasheet.ciiva.com/8340/dcrcwe3-8340197.pdf?src-supplier=Avnet; ComponentLink4Description: https://datasheet.ciiva.com/8340/dcrcwe3-8340197.pdf?src-supplier=Avnet; ComponentLink5URL: https://datasheet.ciiva.com/16941/dcrcw-16941302.pdf?src-supplier=Avnet+Europe; ComponentLink5Description: https://datasheet.ciiva.com/16941/dcrcw-16941302.pdf?src-supplier=Avnet+Europe; ComponentLink6URL: https://datasheet.ciiva.com/16199/dcrcwe3-16199063.pdf?src-supplier=Future+Electronics; ComponentLink6Description: https://datasheet.ciiva.com/16199/dcrcwe3-16199063.pdf?src-supplier=Future+Electronics; ComponentLink7URL: https://datasheet.ciiva.com/16725/70201119-16725175.pdf?src-supplier=Allied+Electronics; ComponentLink7Description: https://datasheet.ciiva.com/16725/70201119-16725175.pdf?src-supplier=Allied+Electronics; ComponentLink8URL: https://datasheet.ciiva.com/26316/fld-crcw-e3-data-en-26316615.pdf?src-supplier=Distrelec; ComponentLink8Description: https://datasheet.ciiva.com/26316/fld-crcw-e3-data-en-26316615.pdf?src-supplier=Distrelec; ComponentLink9URL: https://datasheet.ciiva.com/5544/dcrcwe3-109170-5544344.pdf?src-supplier=Mouser; ComponentLink9Description: https://datasheet.ciiva.com/5544/dcrcwe3-109170-5544344.pdf?src-supplier=Mouser; ComponentLink10URL: https://datasheet.ciiva.com/7841/1720486-7841816.pdf?src-supplier=Element14; ComponentLink10Description: https://datasheet.ciiva.com/7841/1720486-7841816.pdf?src-supplier=Element14; ComponentLink11URL: https://datasheet.ciiva.com/7841/1720486-7841817.pdf?src-supplier=Element14; ComponentLink11Description: https://datasheet.ciiva.com/7841/1720486-7841817.pdf?src-supplier=Element14; ComponentLink12URL: https://datasheet.ciiva.com/7841/125364-7841818.pdf?src-supplier=Element14; ComponentLink12Description: https://datasheet.ciiva.com/7841/125364-7841818.pdf?src-supplier=Element14; ComponentLink13URL: https://datasheet.ciiva.com/16721/70201119-16721450.pdf?src-supplier=Allied+Electronics; ComponentLink13Description: https://datasheet.ciiva.com/16721/70201119-16721450.pdf?src-supplier=Allied+Electronics; Supplier Part Number 1: 541-0.0GCT-ND
TP21-TP23 = TEST_POINT
U5 = HD3SS3212RKSR: Differential Multiplexer, 1 Func, 2 Channel, PQCC20; Manufacturer 1: Texas Instruments; Bandwidth: 8GHz; Min Supply Voltage: 3V; Max Supply Voltage: 3.6V; Data Rate: 480Mbps; Number of Ports: 3; USB Standard: USB 3.1; Supplier 1: Digi-Key; Manufacturer Part Number 1: HD3SS3212RKSR; Stock 1: 36674; Pricing 1: 1=1.79000, 10=1.61000, 100=1.29440, 500=1.06348, 1000=0.88117 (USD); RoHS: Yes; Mount: Standard; Case/Package: VQFN; Number of Pins: 20; Min Operating Temperature: 0°C; Max Operating Temperature: 70°C; Packaging: Tape and Reel; Lead Free: Lead Free; REACH SVHC: No SVHC; ComponentLink1URL: http://www.ti.com/general/docs/lit/getliterature.tsp?genericPartNumber=HD3SS3212&&fileType=pdf&src-supplier=Avnet; ComponentLink1Description: http://www.ti.com/general/docs/lit/getliterature.tsp?genericPartNumber=HD3SS3212&&fileType=pdf&src-supplier=Avnet; ComponentLink2URL: http://www.ti.com/general/docs/lit/getliterature.tsp?genericPartNumber=HD3SS3212&amp;&amp;fileType=pdf&src-supplier=Farnell; ComponentLink2Description: http://www.ti.com/general/docs/lit/getliterature.tsp?genericPartNumber=HD3SS3212&amp;&amp;fileType=pdf&src-supplier=Farnell; ComponentLink3URL: http://www.ti.com/lit/ds/symlink/hd3ss3212.pdf?src-supplier=Digi-Key; ComponentLink3Description: http://www.ti.com/lit/ds/symlink/hd3ss3212.pdf?src-supplier=Digi-Key; ComponentLink4URL: http://www.ti.com/lit/gpn/hd3ss3212?src-supplier=Mouser; ComponentLink4Description: http://www.ti.com/lit/gpn/hd3ss3212?src-supplier=Mouser; ComponentLink5URL: http://www.ti.com/general/docs/lit/getliterature.tsp?genericPartNumber=HD3SS3212&&fileType=pdf&src-supplier=Element14; ComponentLink5Description: http://www.ti.com/general/docs/lit/getliterature.tsp?genericPartNumber=HD3SS3212&&fileType=pdf&src-supplier=Element14; Supplier Part Number 1: 296-42174-1-ND; Supplier 2: Digi-Key; Manufacturer 2: Texas Instruments; Manufacturer Part Number 2: TMUXHS4212RKSR; Stock 2: 908; Pricing 2: 1=1,91000, 10=1,71300, 25=1,61640, 100=1,37730, 250=1,29320, 500=1,13156, 1000=1,01870 (USD)
U6 = TUSB321RWBR: IC USB PORT CONTROL TYPE-C 12X2Q; Manufacturer 1: Texas Instruments; Min Supply Voltage: 4.5V; Max Supply Voltage: 5.5V; Number of Ports: 1; USB Standard: USB 3.1; Supplier 1: Digi-Key; Manufacturer Part Number 1: TUSB321RWBR; Stock 1: 7746; Pricing 1: 1=2.27000, 10=2.04200, 100=1.64100, 500=1.34828, 1000=1.11714 (USD); RoHS: Yes; Mount: Surface Mount; Number of Pins: 12; Contact Plating: Gold; Min Operating Temperature: 0°C; Max Operating Temperature: 70°C; Packaging: Tape and Reel; REACH SVHC: No SVHC; Lead Free: Lead Free; ComponentLink1URL: http://www.ti.com/general/docs/lit/getliterature.tsp?genericPartNumber=TUSB321&&fileType=pdf&src-supplier=Avnet+Asia; ComponentLink1Description: http://www.ti.com/general/docs/lit/getliterature.tsp?genericPartNumber=TUSB321&&fileType=pdf&src-supplier=Avnet+Asia; ComponentLink2URL: http://www.ti.com/general/docs/lit/getliterature.tsp?genericPartNumber=TUSB321&&fileType=pdf&src-supplier=Farnell; ComponentLink2Description: http://www.ti.com/general/docs/lit/getliterature.tsp?genericPartNumber=TUSB321&&fileType=pdf&src-supplier=Farnell; ComponentLink3URL: http://www.ti.com/lit/ds/symlink/tusb321.pdf?src-supplier=Digi-Key; ComponentLink3Description: http://www.ti.com/lit/ds/symlink/tusb321.pdf?src-supplier=Digi-Key; ComponentLink4URL: http://www.ti.com/general/docs/lit/getliterature.tsp?genericPartNumber=TUSB321&&fileType=pdf&src-supplier=Element14; ComponentLink4Description: http://www.ti.com/general/docs/lit/getliterature.tsp?genericPartNumber=TUSB321&&fileType=pdf&src-supplier=Element14; ComponentLink5URL: http://www.ti.com/general/docs/lit/getliterature.tsp?genericPartNumber=TUSB321&&fileType=pdf&src-supplier=Avnet; ComponentLink5Description: http://www.ti.com/general/docs/lit/getliterature.tsp?genericPartNumber=TUSB321&&fileType=pdf&src-supplier=Avnet; Supplier Part Number 1: 296-42400-1-ND